# EAGLE design ipp_8ch (EAGLE 9.6.2)
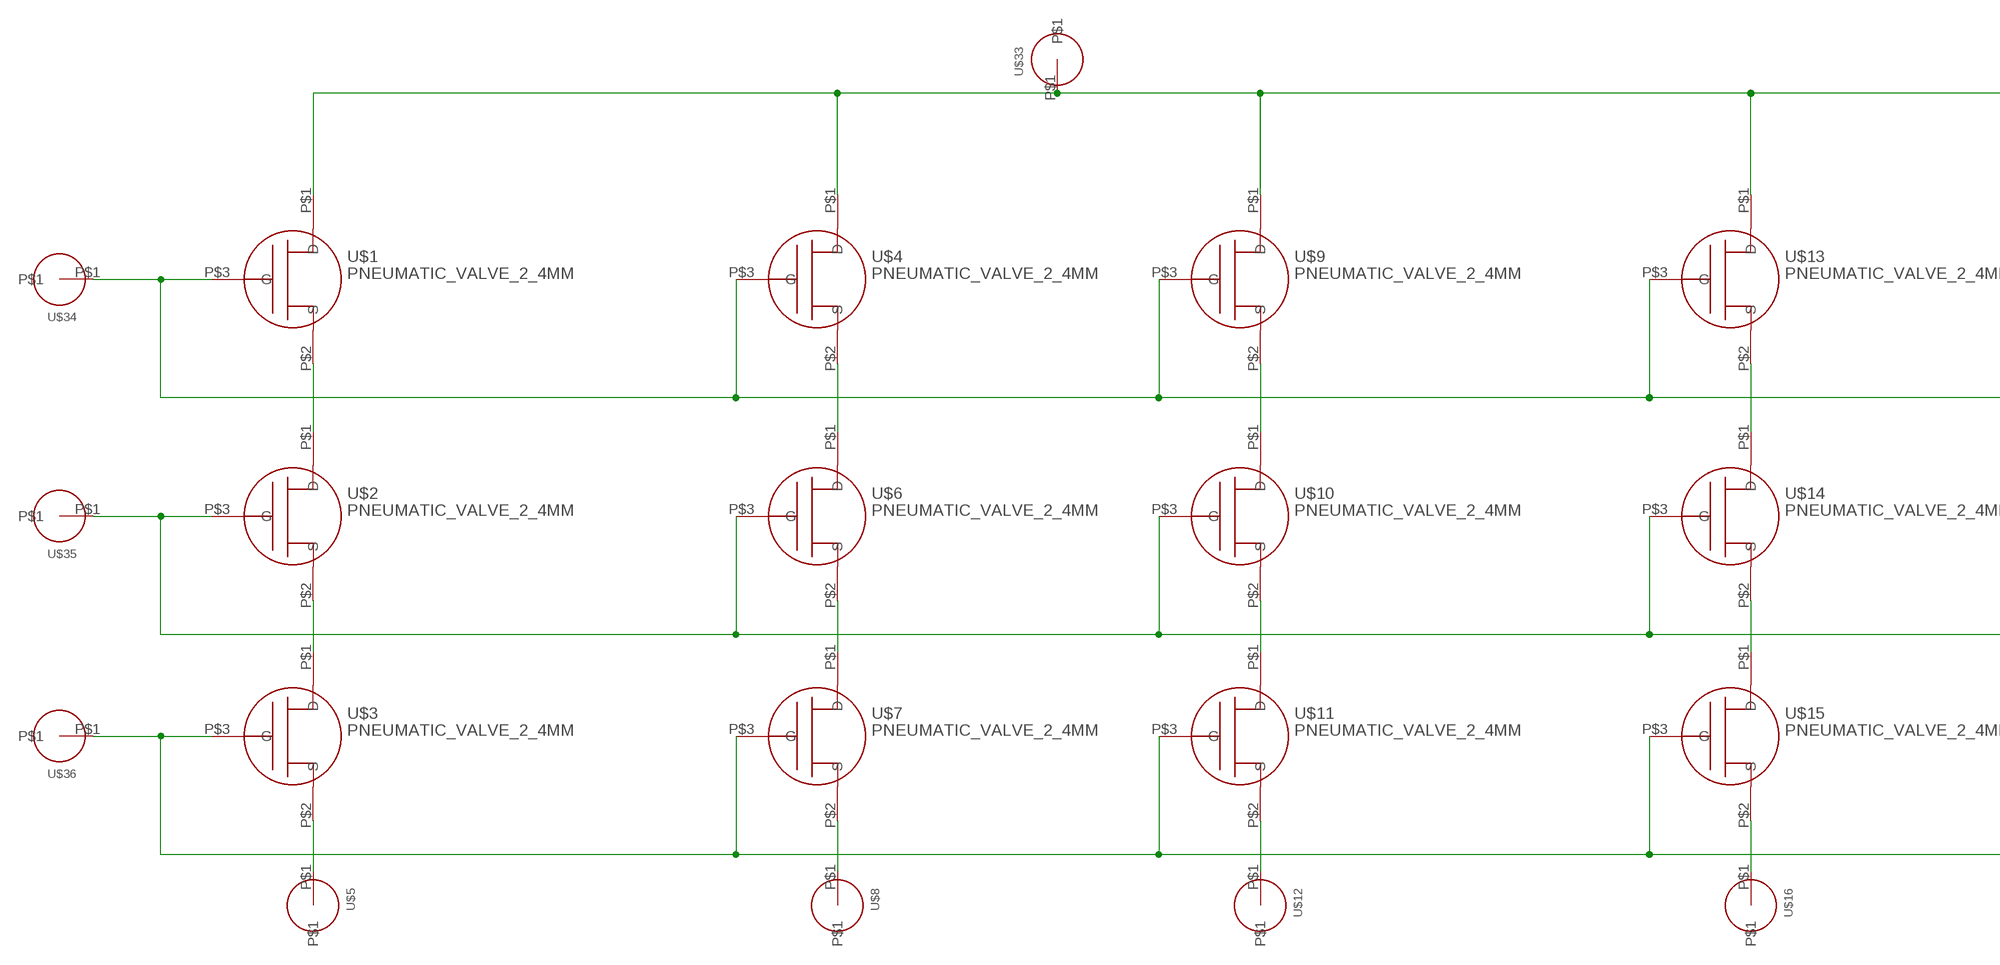
[diagram p0: schematic, sheet 1, part 1 of 2]
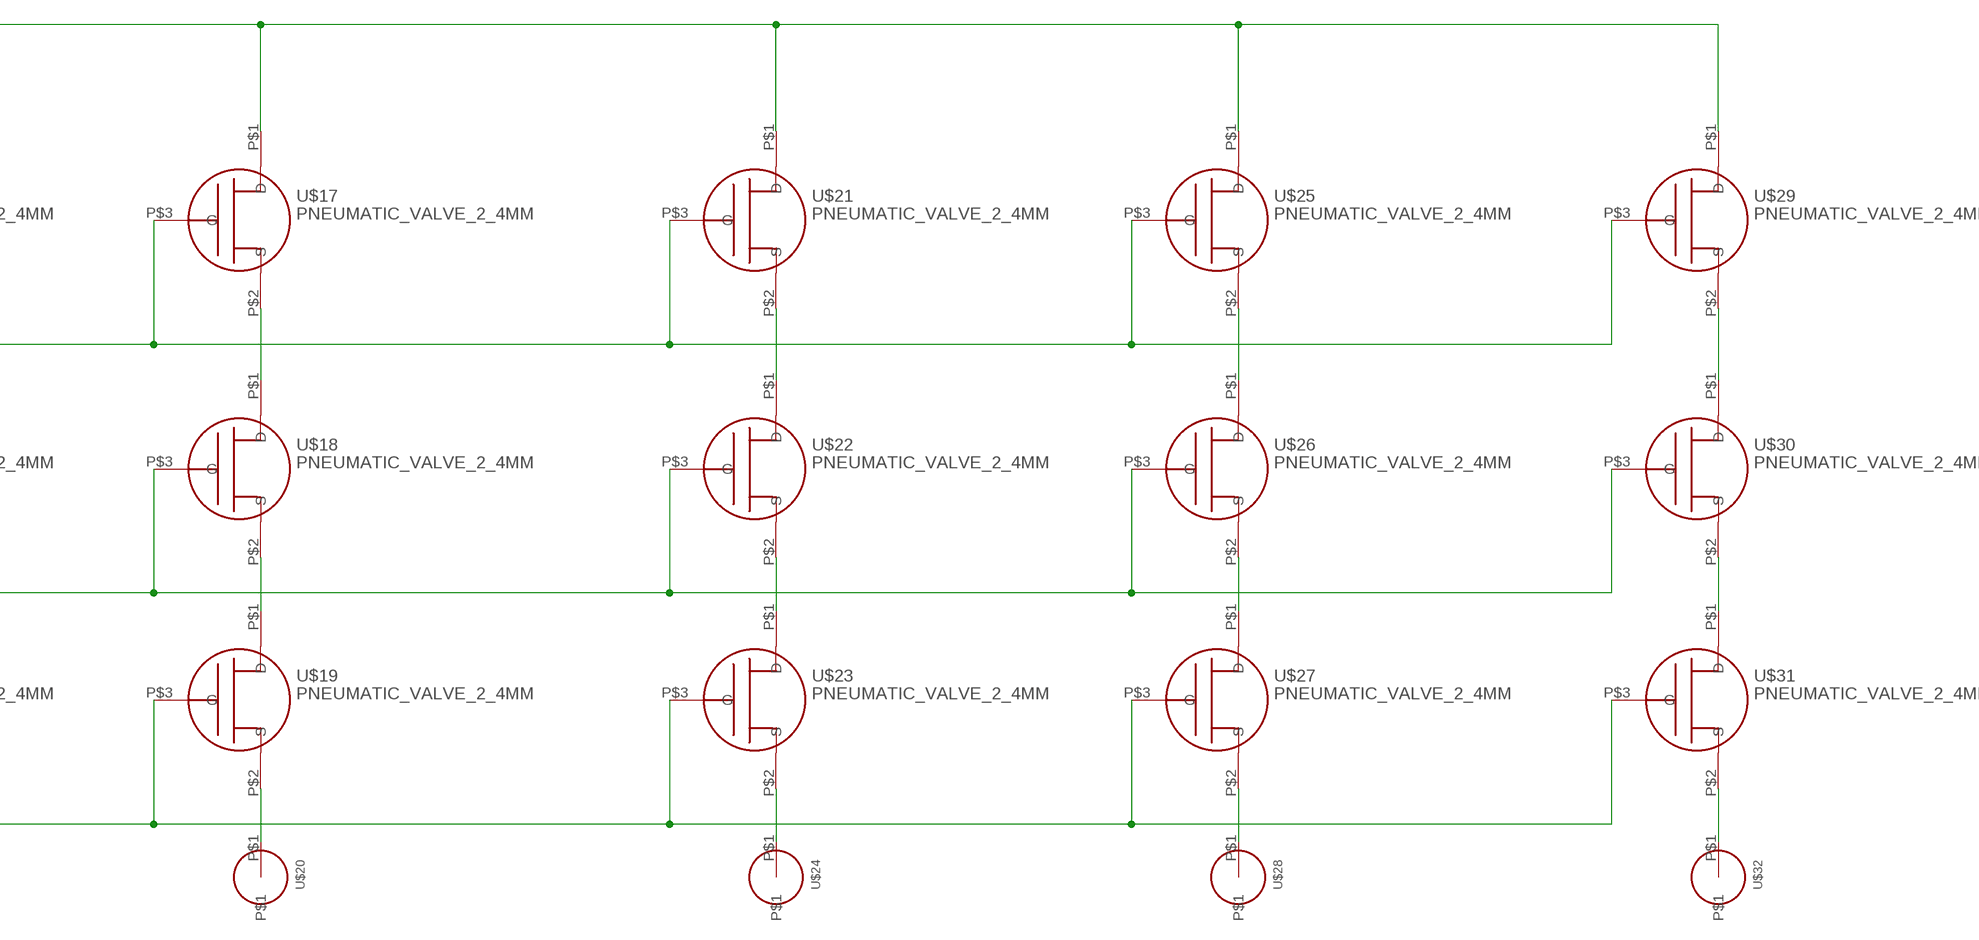
[diagram p1: schematic, sheet 1, part 2 of 2]

## Parts
U$1  PNEUMATIC_VALVE_2_4MM  [2_4MM_PNEUMATIC_VALVE_C5_F4]
U$2  PNEUMATIC_VALVE_2_4MM  [2_4MM_PNEUMATIC_VALVE_C5_F4]
U$3  PNEUMATIC_VALVE_2_4MM  [2_4MM_PNEUMATIC_VALVE_C5_F4]
U$4  PNEUMATIC_VALVE_2_4MM  [2_4MM_PNEUMATIC_VALVE_C5_F4]
U$5  10-32_BARBED_CONNECTOR  [10-32_BARBED_CONNECTOR]
U$6  PNEUMATIC_VALVE_2_4MM  [2_4MM_PNEUMATIC_VALVE_C5_F4]
U$7  PNEUMATIC_VALVE_2_4MM  [2_4MM_PNEUMATIC_VALVE_C5_F4]
U$8  10-32_BARBED_CONNECTOR  [10-32_BARBED_CONNECTOR]
U$9  PNEUMATIC_VALVE_2_4MM  [2_4MM_PNEUMATIC_VALVE_C5_F4]
U$10  PNEUMATIC_VALVE_2_4MM  [2_4MM_PNEUMATIC_VALVE_C5_F4]
U$11  PNEUMATIC_VALVE_2_4MM  [2_4MM_PNEUMATIC_VALVE_C5_F4]
U$12  10-32_BARBED_CONNECTOR  [10-32_BARBED_CONNECTOR]
U$13  PNEUMATIC_VALVE_2_4MM  [2_4MM_PNEUMATIC_VALVE_C5_F4]
U$14  PNEUMATIC_VALVE_2_4MM  [2_4MM_PNEUMATIC_VALVE_C5_F4]
U$15  PNEUMATIC_VALVE_2_4MM  [2_4MM_PNEUMATIC_VALVE_C5_F4]
U$16  10-32_BARBED_CONNECTOR  [10-32_BARBED_CONNECTOR]
U$17  PNEUMATIC_VALVE_2_4MM  [2_4MM_PNEUMATIC_VALVE_C5_F4]
U$18  PNEUMATIC_VALVE_2_4MM  [2_4MM_PNEUMATIC_VALVE_C5_F4]
U$19  PNEUMATIC_VALVE_2_4MM  [2_4MM_PNEUMATIC_VALVE_C5_F4]
U$20  10-32_BARBED_CONNECTOR  [10-32_BARBED_CONNECTOR]
U$21  PNEUMATIC_VALVE_2_4MM  [2_4MM_PNEUMATIC_VALVE_C5_F4]
U$22  PNEUMATIC_VALVE_2_4MM  [2_4MM_PNEUMATIC_VALVE_C5_F4]
U$23  PNEUMATIC_VALVE_2_4MM  [2_4MM_PNEUMATIC_VALVE_C5_F4]
U$24  10-32_BARBED_CONNECTOR  [10-32_BARBED_CONNECTOR]
U$25  PNEUMATIC_VALVE_2_4MM  [2_4MM_PNEUMATIC_VALVE_C5_F4]
U$26  PNEUMATIC_VALVE_2_4MM  [2_4MM_PNEUMATIC_VALVE_C5_F4]
U$27  PNEUMATIC_VALVE_2_4MM  [2_4MM_PNEUMATIC_VALVE_C5_F4]
U$28  10-32_BARBED_CONNECTOR  [10-32_BARBED_CONNECTOR]
U$29  PNEUMATIC_VALVE_2_4MM  [2_4MM_PNEUMATIC_VALVE_C5_F4]
U$30  PNEUMATIC_VALVE_2_4MM  [2_4MM_PNEUMATIC_VALVE_C5_F4]
U$31  PNEUMATIC_VALVE_2_4MM  [2_4MM_PNEUMATIC_VALVE_C5_F4]
U$32  10-32_BARBED_CONNECTOR  [10-32_BARBED_CONNECTOR]
U$33  10-32_BARBED_CONNECTOR  [10-32_BARBED_CONNECTOR]
U$34  10-32_BARBED_CONNECTOR  [10-32_BARBED_CONNECTOR]
U$35  10-32_BARBED_CONNECTOR  [10-32_BARBED_CONNECTOR]
U$36  10-32_BARBED_CONNECTOR  [10-32_BARBED_CONNECTOR]

## Nets
N$1: U$1.P$2(S) U$2.P$1(D)
N$2: U$2.P$2(S) U$3.P$1(D)
N$3: U$4.P$2(S) U$6.P$1(D)
N$4: U$3.P$2(S) U$5.P$1
N$5: U$6.P$2(S) U$7.P$1(D)
N$6: U$7.P$2(S) U$8.P$1
N$7: U$9.P$2(S) U$10.P$1(D)
N$8: U$10.P$2(S) U$11.P$1(D)
N$9: U$11.P$2(S) U$12.P$1
N$10: U$13.P$2(S) U$14.P$1(D)
N$11: U$14.P$2(S) U$15.P$1(D)
N$12: U$15.P$2(S) U$16.P$1
N$13: U$17.P$2(S) U$18.P$1(D)
N$14: U$18.P$2(S) U$19.P$1(D)
N$15: U$19.P$2(S) U$20.P$1
N$16: U$21.P$2(S) U$22.P$1(D)
N$17: U$22.P$2(S) U$23.P$1(D)
N$18: U$23.P$2(S) U$24.P$1
N$19: U$25.P$2(S) U$26.P$1(D)
N$20: U$26.P$2(S) U$27.P$1(D)
N$21: U$27.P$2(S) U$28.P$1
N$22: U$29.P$2(S) U$30.P$1(D)
N$23: U$30.P$2(S) U$31.P$1(D)
N$24: U$31.P$2(S) U$32.P$1
N$25: U$1.P$1(D) U$4.P$1(D) U$9.P$1(D) U$13.P$1(D) U$17.P$1(D) U$21.P$1(D) U$25.P$1(D) U$29.P$1(D) U$33.P$1
N$26: U$1.P$3(G) U$4.P$3(G) U$9.P$3(G) U$13.P$3(G) U$17.P$3(G) U$21.P$3(G) U$25.P$3(G) U$29.P$3(G) U$34.P$1
N$27: U$2.P$3(G) U$6.P$3(G) U$10.P$3(G) U$14.P$3(G) U$18.P$3(G) U$22.P$3(G) U$26.P$3(G) U$30.P$3(G) U$35.P$1
N$28: U$3.P$3(G) U$7.P$3(G) U$11.P$3(G) U$15.P$3(G) U$19.P$3(G) U$23.P$3(G) U$27.P$3(G) U$31.P$3(G) U$36.P$1

## Library data of the parts
U$1-U$4 U$6 U$7 U$9-U$11 U$13-U$15 U$17-U$19 U$21-U$23 U$25-U$27 U$29-U$31 = Millfluidics_Library:PNEUMATIC_VALVE_2_4MM
U$5 U$8 U$12 U$16 U$20 U$24 U$28 U$32-U$36 = Millfluidics_Library:10-32_BARBED_CONNECTOR

## Board
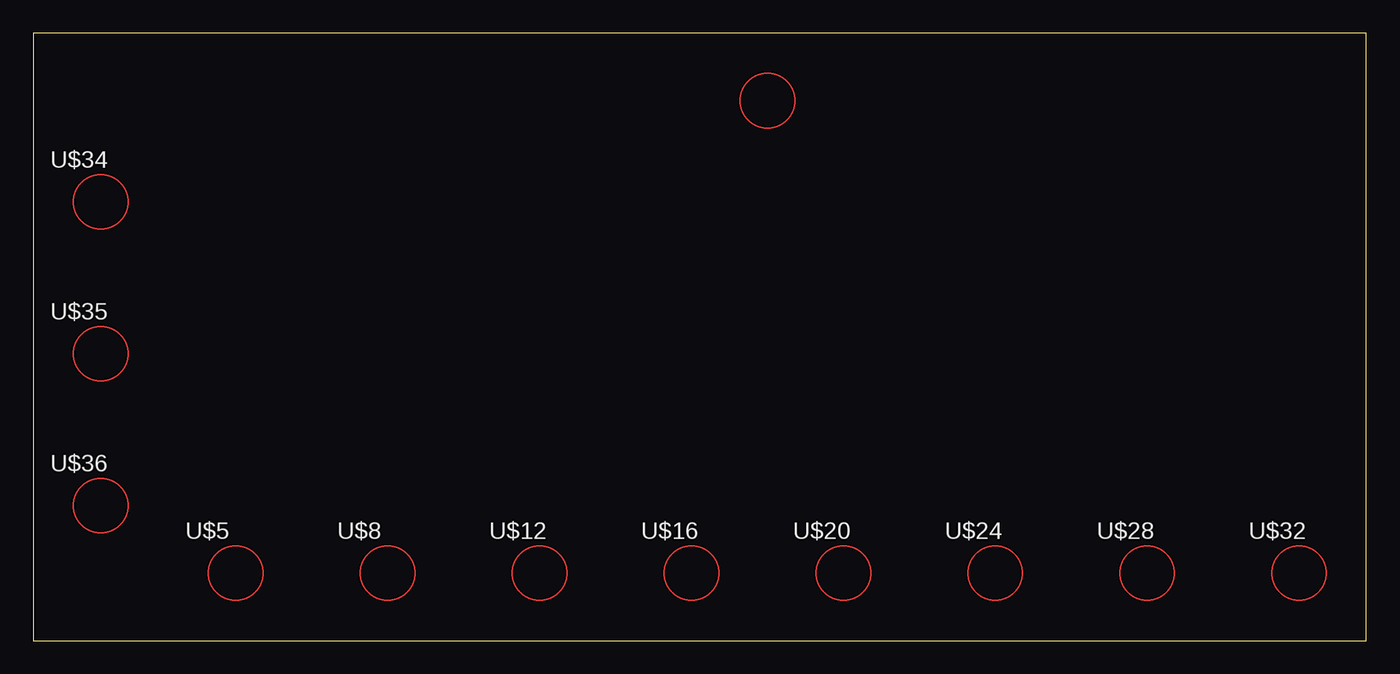
[diagram p2: board, top side]
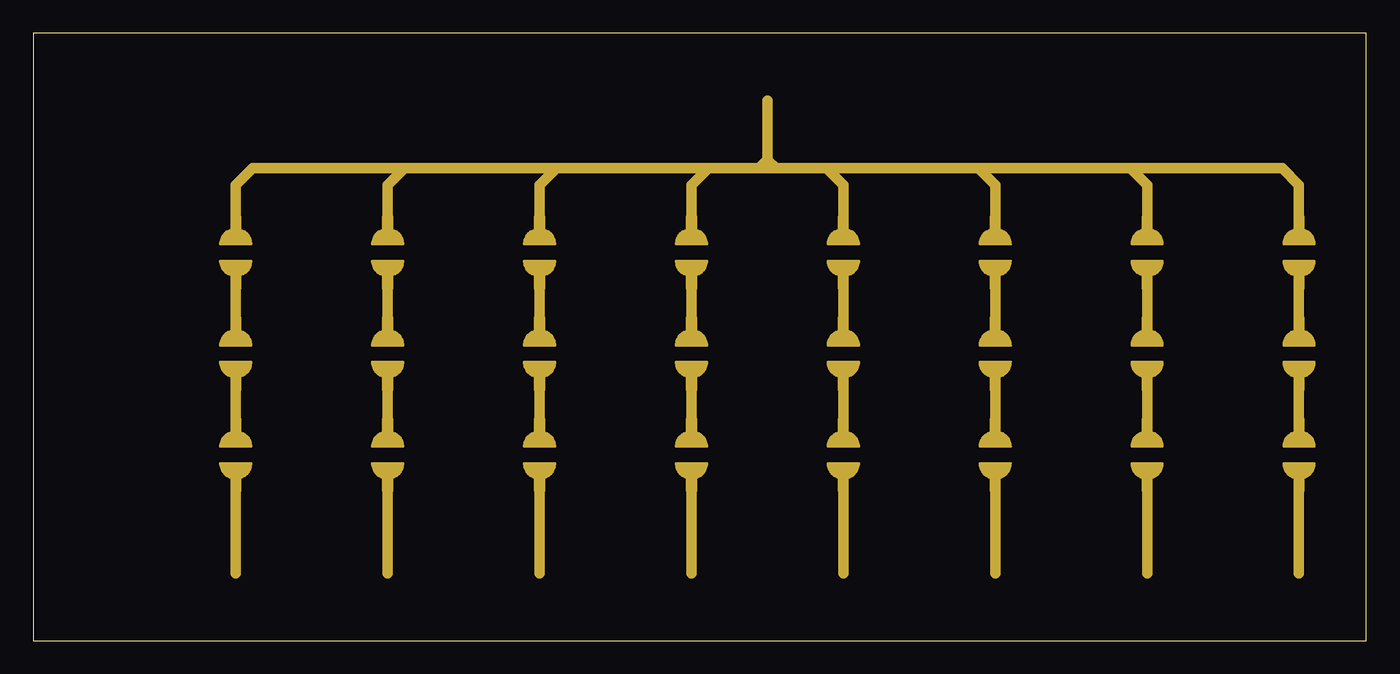
[diagram p3: board, inner layer L4-S1B]
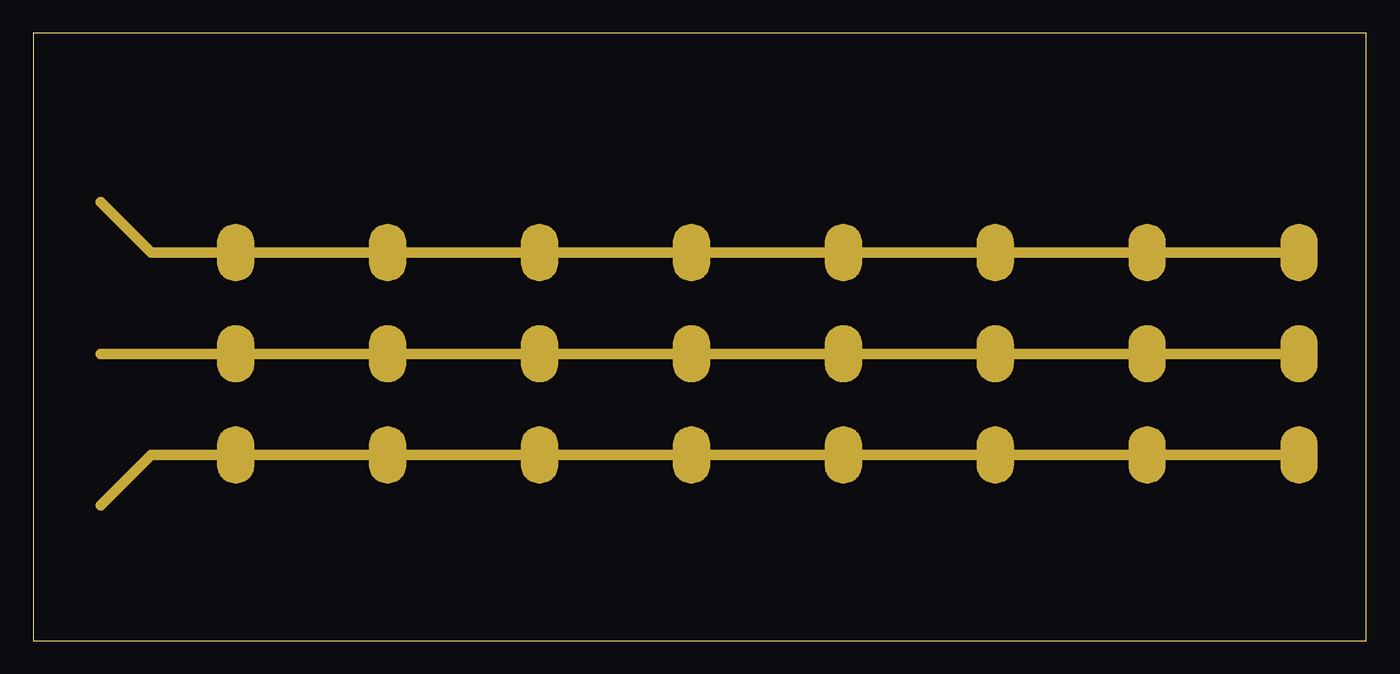
[diagram p4: board, inner layer L5-S2T]

Size 100.31 x 45.72 mm. Coordinates in mm from the lower left corner, seen from the top.
Outline: 0,0 100.31,0 100.31,45.72 0,45.72 0,0
Copper layers (1*2*3*4)*(5*6*7*8)*(9*10*11*12)*(13*14*15*16): L1-S1T 0.035mm / dielectric 0.15mm / L2-S1R 0.035mm / dielectric 0.15mm / L3-S1R 0.035mm / dielectric 0.2mm / L4-S1B 0.035mm / dielectric 0.15mm / L5-S2T 0.035mm / dielectric 0.2mm / L6-S2R 0.035mm / dielectric 0.15mm / L7-S2R 0.035mm / dielectric 0.2mm / L8-S2B 0.035mm / dielectric 0.15mm / L9-S3T 0.035mm / dielectric 0.2mm / L10-S3R 0.035mm / dielectric 0.15mm / L11-S3R 0.035mm / dielectric 0.2mm / L12-S3B 0.035mm / dielectric 0.15mm / L13-S4T 0.035mm / dielectric 0.2mm / L13-S4R 0.035mm / dielectric 0.15mm / L14-S4R 0.035mm / dielectric 0.2mm / L16-S4B 0.035mm
Design rules "default *": minimum track width 0.00011875mm, minimum drill 0.00011875mm, track to track 6mil, track to pad 6mil, pad to pad 6mil, via to via 6mil, smd to smd 6mil, copper to edge 40mil, drill to drill 6mil, minimum pad ring 0.00011875mm, minimum via ring 0.00011875mm, stop-mask expansion 4mil, vias tented up to drill 0mil, thermal gap 10mil

### Footprints (pad centres in the part's own frame; a part is rotated, then mirrored left to right if it is on the bottom)
2_4MM_PNEUMATIC_VALVE_C5_F4 = drill 0 pad 0: P$1 -2.75,0; P$2 2.75,0; P$3 0,-0.02
10-32_BARBED_CONNECTOR = drill 0 pad 0: P$1 0,0

### Placement (x,y rotation side)
U$1  15.24,29.21 270 top
U$2  15.24,21.59 270 top
U$3  15.24,13.97 270 top
U$4  26.67,29.21 270 top
U$5  15.24,5.08 0 top
U$6  26.67,21.59 270 top
U$7  26.67,13.97 270 top
U$8  26.67,5.08 0 top
U$9  38.1,29.21 270 top
U$10  38.1,21.59 270 top
U$11  38.1,13.97 270 top
U$12  38.1,5.08 0 top
U$13  49.53,29.21 270 top
U$14  49.53,21.59 270 top
U$15  49.53,13.97 270 top
U$16  49.53,5.08 0 top
U$17  60.96,29.21 270 top
U$18  60.96,21.59 270 top
U$19  60.96,13.97 270 top
U$20  60.96,5.08 0 top
U$21  72.39,29.21 270 top
U$22  72.39,21.59 270 top
U$23  72.39,13.97 270 top
U$24  72.39,5.08 0 top
U$25  83.82,29.21 270 top
U$26  83.82,21.59 270 top
U$27  83.82,13.97 270 top
U$28  83.82,5.08 0 top
U$29  95.25,29.21 270 top
U$30  95.25,21.59 270 top
U$31  95.25,13.97 270 top
U$32  95.25,5.08 0 top
U$33  55.26,40.64 0 top
U$34  5.08,33.02 0 top
U$35  5.08,21.59 0 top
U$36  5.08,10.16 0 top

### Tracks (layer width: path | path; a pad name or v marks a point on that pad's centre or on a via)
N$1
  L4-S1B 0.8: U$1.P$2 U$2.P$1
N$2
  L4-S1B 0.8: U$2.P$2 U$3.P$1
N$3
  L4-S1B 0.8: U$4.P$2 U$6.P$1
N$4
  L4-S1B 0.8: U$3.P$2 U$5.P$1
N$5
  L4-S1B 0.8: U$6.P$2 U$7.P$1
N$6
  L4-S1B 0.8: U$7.P$2 U$8.P$1
N$7
  L4-S1B 0.8: U$9.P$2 U$10.P$1
N$8
  L4-S1B 0.8: U$10.P$2 U$11.P$1
N$9
  L4-S1B 0.8: U$11.P$2 U$12.P$1
N$10
  L4-S1B 0.8: U$13.P$2 U$14.P$1
N$11
  L4-S1B 0.8: U$14.P$2 U$15.P$1
N$12
  L4-S1B 0.8: U$15.P$2 U$16.P$1
N$13
  L4-S1B 0.8: U$17.P$2 U$18.P$1 | U$18.P$1
N$14
  L4-S1B 0.8: U$18.P$2 U$19.P$1
N$15
  L4-S1B 0.8: U$19.P$2 U$20.P$1
N$16
  L4-S1B 0.8: U$21.P$2 U$22.P$1
N$17
  L4-S1B 0.8: U$22.P$2 U$23.P$1
N$18
  L4-S1B 0.8: U$23.P$2 U$24.P$1
N$19
  L4-S1B 0.8: U$25.P$2 U$26.P$1
N$20
  L4-S1B 0.8: U$26.P$2 U$27.P$1
N$21
  L4-S1B 0.8: U$27.P$2 U$28.P$1
N$22
  L4-S1B 0.8: U$29.P$2 U$30.P$1
N$23
  L4-S1B 0.8: U$30.P$2 U$31.P$1
N$24
  L4-S1B 0.8: U$31.P$2 U$32.P$1
N$25
  L4-S1B 0.8: U$1.P$1 15.24,34.29 16.51,35.56 27.94,35.56 | 27.94,35.56 39.37,35.56 | 39.37,35.56 50.8,35.56 | 50.8,35.56 54.61,35.56 | 54.61,35.56 55.88,35.56 | 55.88,35.56 59.69,35.56 | 59.69,35.56 71.12,35.56 | 71.12,35.56 82.55,35.56 | 82.55,35.56 93.98,35.56 95.25,34.29 U$29.P$1 | U$25.P$1 83.82,34.29 82.55,35.56 | U$21.P$1 72.39,34.29 71.12,35.56 | U$17.P$1 60.96,34.29 | 60.96,34.29 | 60.96,34.29 59.69,35.56 | U$13.P$1 49.53,34.29 50.8,35.56 | U$9.P$1 38.1,34.29 39.37,35.56 | U$4.P$1 26.67,34.29 27.94,35.56 | 54.61,35.56 55.26,36.21 U$33.P$1 55.26,36.18 55.88,35.56
N$26
  L5-S2T 0.8: U$34.P$1 8.89,29.21 U$1.P$3 U$4.P$3 U$9.P$3 U$13.P$3 U$17.P$3 U$21.P$3 U$25.P$3 U$29.P$3
N$27
  L5-S2T 0.8: U$35.P$1 U$2.P$3 U$6.P$3 U$10.P$3 U$14.P$3 U$18.P$3 U$22.P$3 U$26.P$3 U$30.P$3
N$28
  L5-S2T 0.8: U$36.P$1 8.89,13.97 U$3.P$3 U$7.P$3 U$11.P$3 U$15.P$3 U$19.P$3 U$23.P$3 U$27.P$3 U$31.P$3